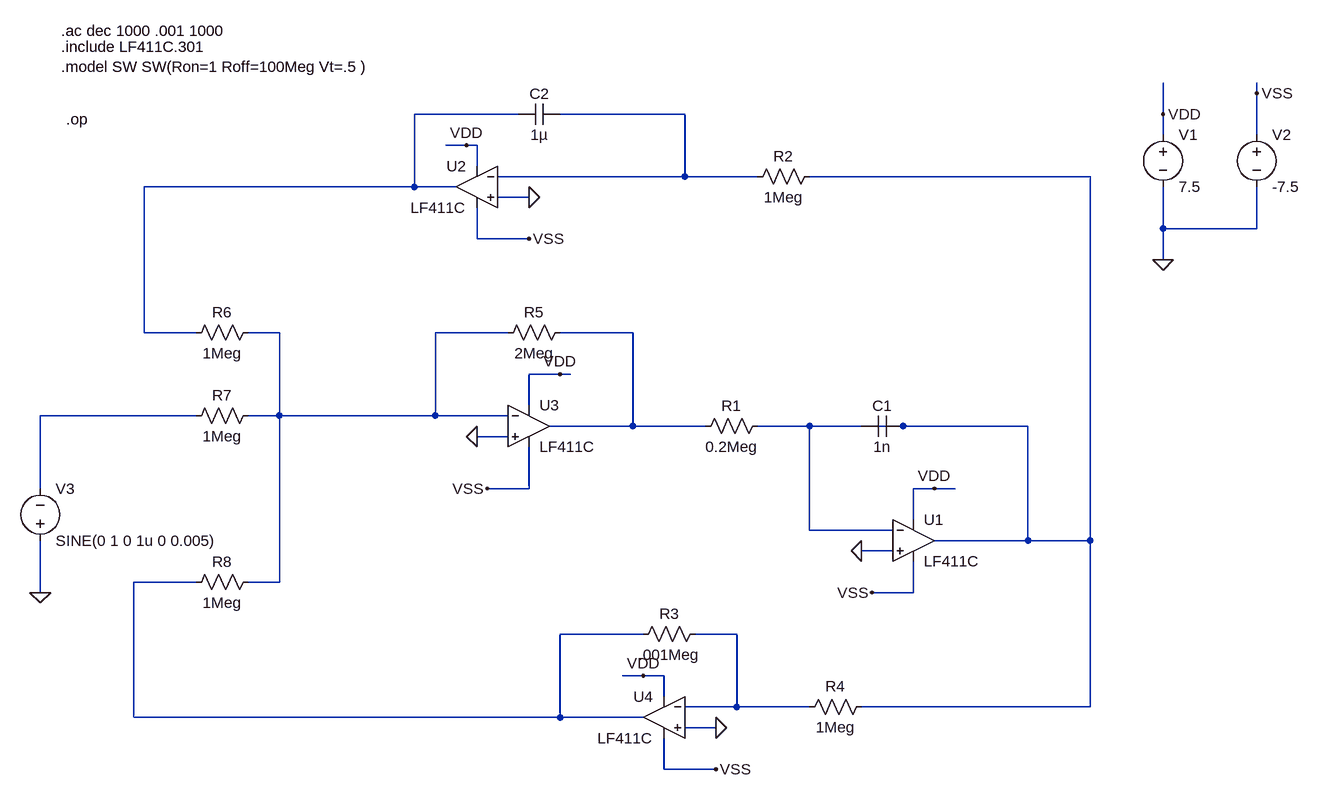
[diagram p0: schematic EXP 4.asc]
EXP 4.asc, the LTspice schematic file:
Version 4
SHEET 1 1288 960
WIRE 1216 -128 1216 -144
WIRE 80 -96 -80 -96
WIRE 336 -96 144 -96
WIRE 1072 -96 1072 -144
WIRE 1072 -64 1072 -96
WIRE 1216 -64 1216 -128
WIRE 0 -48 -32 -48
WIRE 16 -48 0 -48
WIRE 16 -16 16 -48
WIRE 336 0 336 -96
WIRE 336 0 48 0
WIRE 448 0 336 0
WIRE 960 0 528 0
WIRE -80 16 -80 -96
WIRE -80 16 -496 16
WIRE -16 16 -80 16
WIRE 96 32 48 32
WIRE 1072 80 1072 16
WIRE 1216 80 1216 16
WIRE 1216 80 1072 80
WIRE 16 96 16 48
WIRE 96 96 16 96
WIRE 1072 128 1072 80
WIRE -496 240 -496 16
WIRE -416 240 -496 240
WIRE -288 240 -336 240
WIRE 64 240 -48 240
WIRE 256 240 144 240
WIRE 144 304 96 304
WIRE 160 304 144 304
WIRE 96 352 96 304
WIRE -416 368 -656 368
WIRE -288 368 -288 240
WIRE -288 368 -336 368
WIRE -48 368 -48 240
WIRE -48 368 -288 368
WIRE 64 368 -48 368
WIRE 256 384 256 240
WIRE 256 384 128 384
WIRE 368 384 256 384
WIRE 528 384 448 384
WIRE 608 384 528 384
WIRE 672 384 624 384
WIRE 864 384 672 384
WIRE 64 400 16 400
WIRE -656 480 -656 368
WIRE 96 480 96 416
WIRE 96 480 32 480
WIRE 720 480 688 480
WIRE 752 480 720 480
WIRE 688 528 688 480
WIRE 528 544 528 384
WIRE 656 544 528 544
WIRE 864 560 864 384
WIRE 864 560 720 560
WIRE 960 560 960 0
WIRE 960 560 864 560
WIRE 656 576 608 576
WIRE -416 624 -512 624
WIRE -288 624 -288 368
WIRE -288 624 -336 624
WIRE -656 640 -656 560
WIRE 688 640 688 592
WIRE 688 640 624 640
WIRE 272 704 144 704
WIRE 416 704 352 704
WIRE 272 768 240 768
WIRE 304 768 272 768
WIRE 304 800 304 768
WIRE 416 816 416 704
WIRE 416 816 336 816
WIRE 528 816 416 816
WIRE 960 816 960 560
WIRE 960 816 608 816
WIRE -512 832 -512 624
WIRE 144 832 144 704
WIRE 144 832 -512 832
WIRE 272 832 144 832
WIRE 384 848 336 848
WIRE 304 912 304 864
WIRE 384 912 304 912
FLAG 1072 128 0
FLAG 1072 -96 VDD
FLAG 1216 -128 VSS
FLAG 608 576 0
FLAG 96 32 0
FLAG 16 400 0
FLAG 384 848 0
FLAG 272 768 VDD
FLAG 384 912 VSS
FLAG 720 480 VDD
FLAG 624 640 VSS
FLAG -656 640 0
FLAG 0 -48 VDD
FLAG 96 96 VSS
FLAG 144 304 VDD
FLAG 32 480 VSS
SYMBOL voltage 1072 -80 R0
SYMATTR InstName V1
SYMATTR Value 7.5
SYMBOL voltage 1216 -80 R0
SYMATTR InstName V2
SYMATTR Value -7.5
SYMBOL Cap 672 368 R90
WINDOW 0 0 32 VBottom 2
WINDOW 3 32 32 VTop 2
SYMATTR InstName C1
SYMATTR Value 1n
SYMBOL OpAmps/opamp2 688 496 R0
SYMATTR InstName U1
SYMATTR Value LF411C
SYMBOL Res 464 368 R90
WINDOW 0 0 56 VBottom 2
WINDOW 3 32 56 VTop 2
SYMATTR InstName R1
SYMATTR Value 0.2Meg
SYMBOL OpAmps/opamp2 16 -48 M0
SYMATTR InstName U2
SYMATTR Value LF411C
SYMBOL Cap 144 -112 R90
WINDOW 0 0 32 VBottom 2
WINDOW 3 32 32 VTop 2
SYMATTR InstName C2
SYMATTR Value 1µ
SYMBOL Res 544 -16 R90
WINDOW 0 0 56 VBottom 2
WINDOW 3 32 56 VTop 2
SYMATTR InstName R2
SYMATTR Value 1Meg
SYMBOL OpAmps/opamp2 96 320 R0
SYMATTR InstName U3
SYMATTR Value LF411C
SYMBOL Res 368 688 R90
WINDOW 0 0 56 VBottom 2
WINDOW 3 32 56 VTop 2
SYMATTR InstName R3
SYMATTR Value .001Meg
SYMBOL OpAmps/opamp2 304 768 M0
SYMATTR InstName U4
SYMATTR Value LF411C
SYMBOL Res 624 800 R90
WINDOW 0 0 56 VBottom 2
WINDOW 3 32 56 VTop 2
SYMATTR InstName R4
SYMATTR Value 1Meg
SYMBOL Res 160 224 R90
WINDOW 0 0 56 VBottom 2
WINDOW 3 32 56 VTop 2
SYMATTR InstName R5
SYMATTR Value 2Meg
SYMBOL Res -320 224 R90
WINDOW 0 0 56 VBottom 2
WINDOW 3 32 56 VTop 2
SYMATTR InstName R6
SYMATTR Value 1Meg
SYMBOL Res -320 352 R90
WINDOW 0 0 56 VBottom 2
WINDOW 3 32 56 VTop 2
SYMATTR InstName R7
SYMATTR Value 1Meg
SYMBOL Res -320 608 R90
WINDOW 0 0 56 VBottom 2
WINDOW 3 32 56 VTop 2
SYMATTR InstName R8
SYMATTR Value 1Meg
SYMBOL voltage -656 576 M180
WINDOW 0 24 96 Left 2
WINDOW 3 24 16 Left 2
SYMATTR InstName V3
SYMATTR Value SINE(0 1 0 1u 0 0.005)
SYMATTR Value2 AC 1 0
TEXT -624 -200 Left 2 !.include LF411C.301\n.model SW SW(Ron=1 Roff=100Meg Vt=.5 )
TEXT -624 -224 Left 2 !.ac dec 1000 .001 1000
TEXT -616 -88 Left 2 !.op

The netlist it stands for:
* EXP 4.asc
V1 VDD 0 7.5
V2 VSS 0 -7.5
C1 N003 N007 1n
XU1 0 N007 VDD VSS N003 LF411C  ; pins In+ In- V+ V- OUT
R1 N007 N005 0.2Meg
XU2 0 N002 VDD VSS N001 LF411C  ; pins In+ In- V+ V- OUT
C2 N002 N001 1µ
R2 N003 N002 1Meg
XU3 0 N004 VDD VSS N005 LF411C  ; pins In+ In- V+ V- OUT
R3 N009 N008 .001Meg
XU4 0 N009 VDD VSS N008 LF411C  ; pins In+ In- V+ V- OUT
R4 N003 N009 1Meg
R5 N005 N004 2Meg
R6 N004 N001 1Meg
R7 N004 N006 1Meg
R8 N004 N008 1Meg
V3 0 N006 SINE(0 1 0 1u 0 0.005) AC 1 0
.include LF411C.301
.model SW SW(Ron=1 Roff=100Meg Vt=.5 )
.ac dec 1000 .001 1000
.op
.backanno
.end